# Altium schematic sheet USBC-DS1-100W-PD.SchDoc
size A3; SheetNumber: 1; SheetTotal: 4; SPICEModelCacheUZKMSWNJ: <root> / <DocumentId>UZKMSWNJ</DocumentId> / </root>
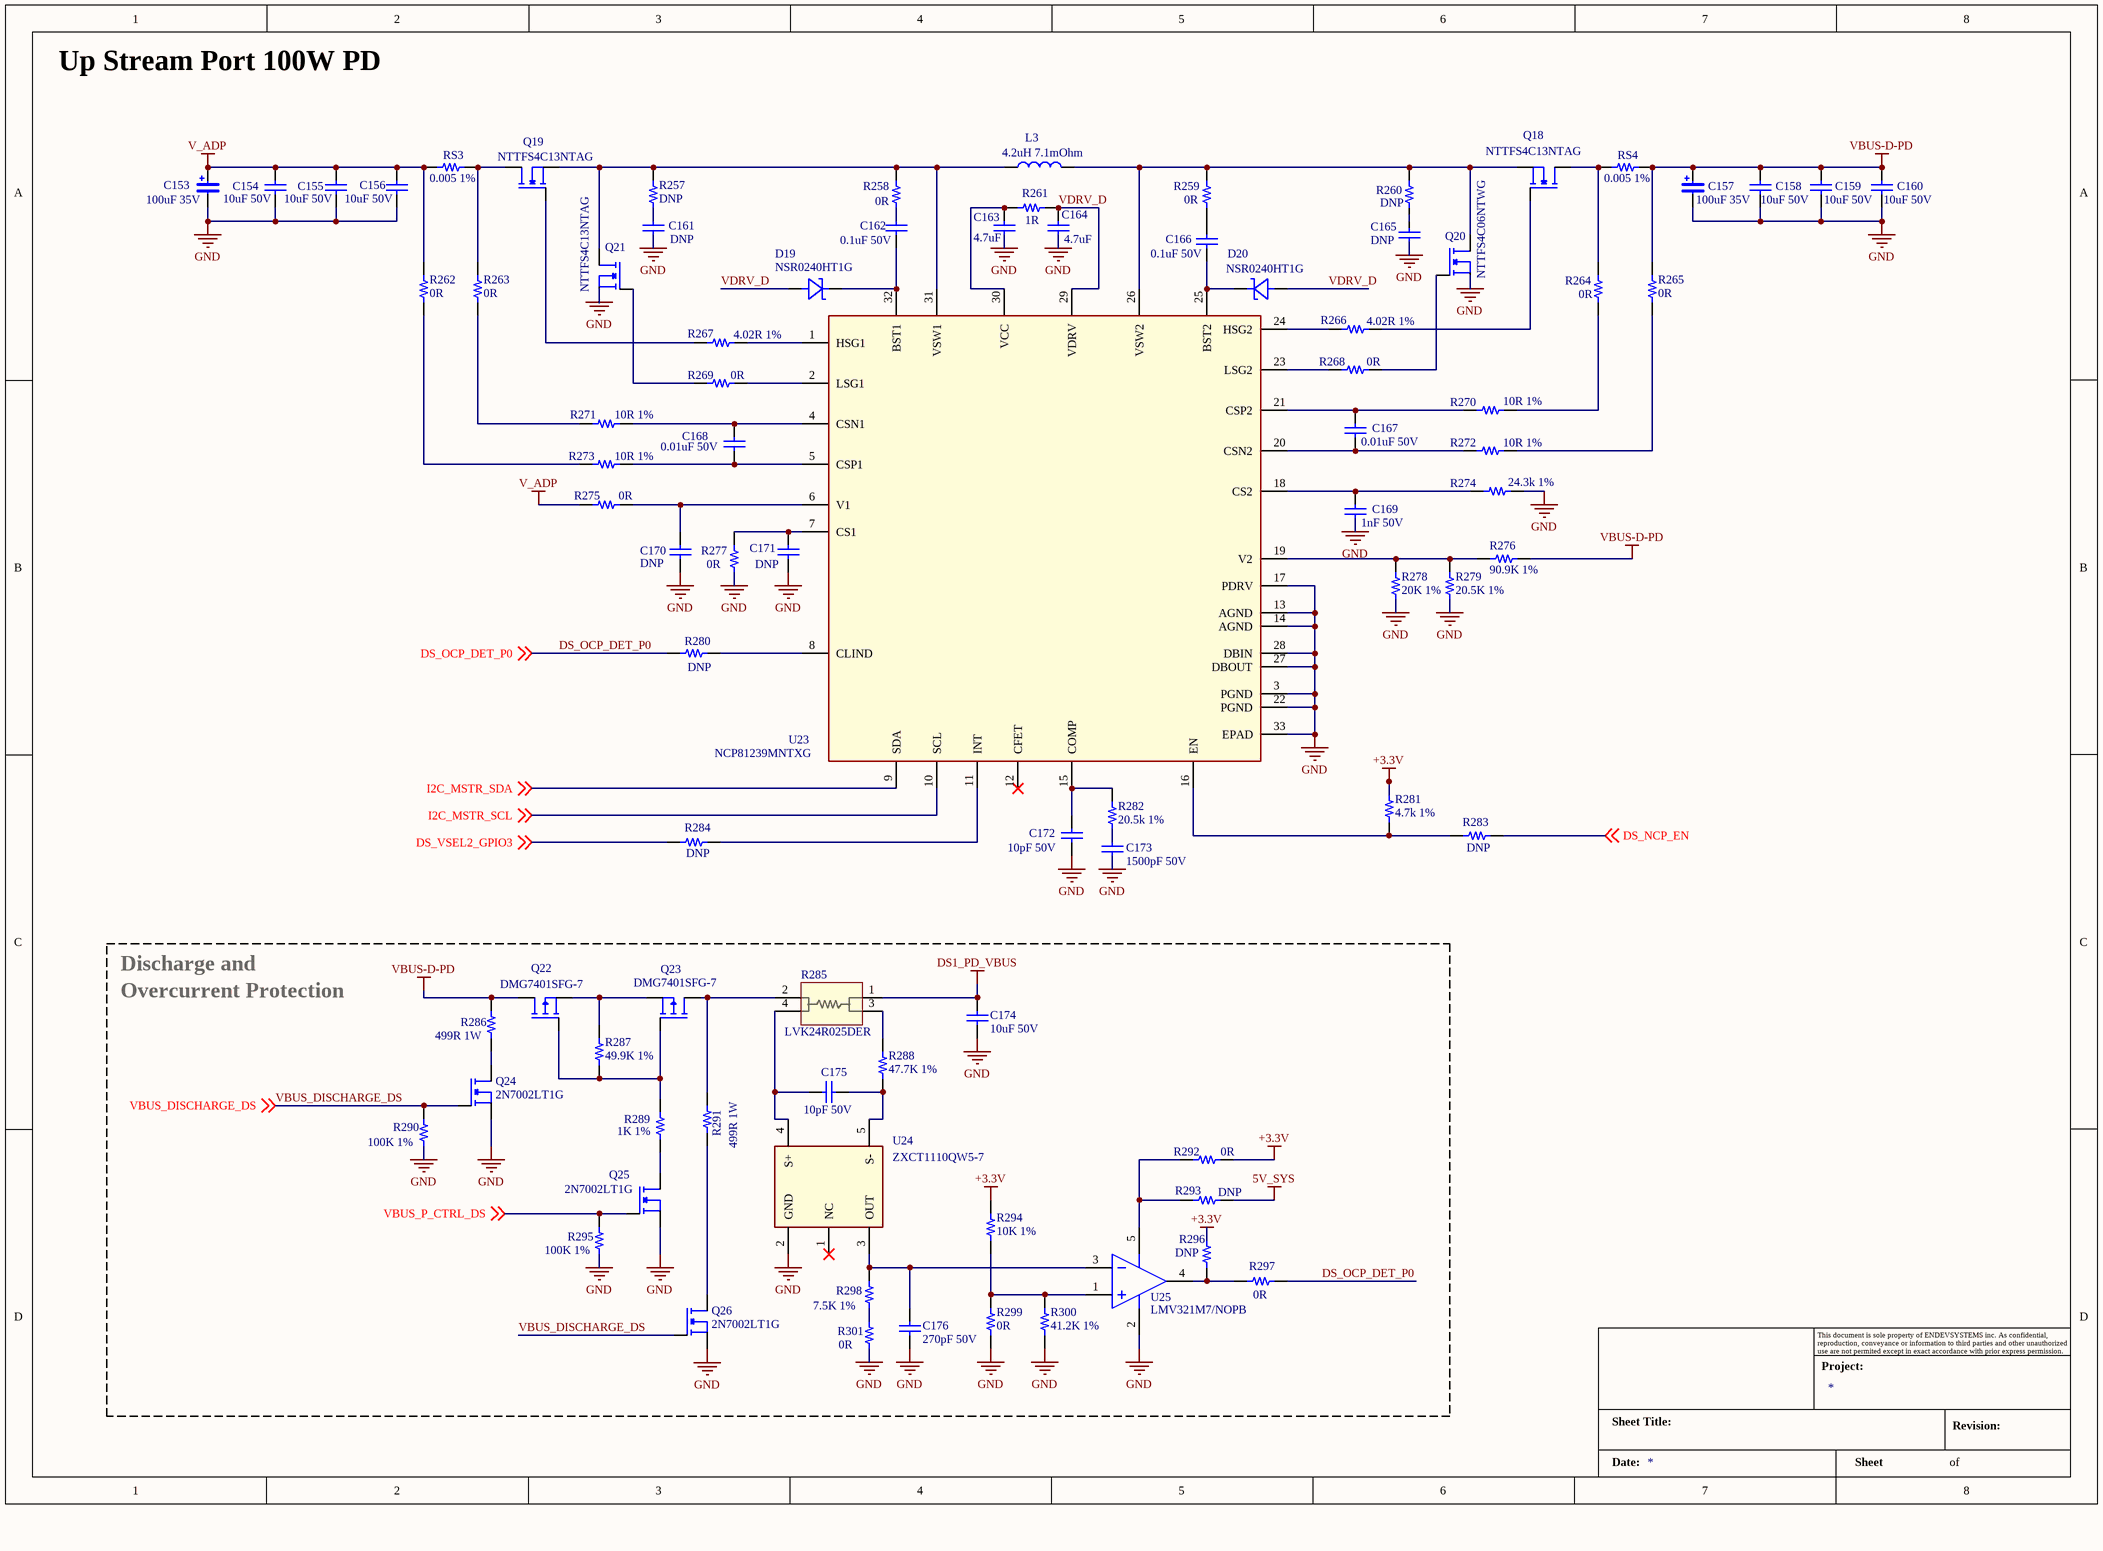
[diagram p0: USBC-DS1-100W-PD.SchDoc]

## Parts
?  Title_Block  (value not drawn)  (graphical)
C153  100uF 35V  [C-1206 (Tantalum)]
C154  10uF 50V  [C-0402/1005]
C155  10uF 50V  [C-0402/1005]
C156  10uF 50V  [C-0402/1005]
C157  100uF 35V  [C-1206 (Tantalum)]
C158  10uF 50V  [C-0402/1005]
C159  10uF 50V  [C-0402/1005]
C160  10uF 50V  [C-0402/1005]
C161  DNP  [C-0402/1005]
C162  0.1uF 50V  [C-0402/1005]
C163  4.7uF  [C-0402/1005]
C164  4.7uF  [C-0402/1005]
C165  DNP  [C-0402/1005]
C166  0.1uF 50V  [C-0402/1005]
C167  0.01uF 50V  [C-0402/1005]
C168  0.01uF 50V  [C-0402/1005]
C169  1nF 50V  [C-0402/1005]
C170  DNP  [C-0402/1005]
C171  DNP  [C-0402/1005]
C172  10pF 50V  [C-0402/1005]
C173  1500pF 50V  [C-0402/1005]
C174  value 10uF 50V  [C-0402/1005]  (hidden comment: 0.1uF)
C175  value 10pF 50V  [C-0402/1005]  (hidden comment: 0.1uF)
C176  value 270pF 50V  [C-0402/1005]  (hidden comment: 0.1uF)
D19  NSR0240HT1G  [SOIC-8 (W3.9mm) B]
D20  NSR0240HT1G  [SOIC-8 (W3.9mm) B]
L3  4.2uH 7.1mOhm  [4.3x4.3mm]
Q18  NTTFS4C13NTAG
Q19  NTTFS4C13NTAG
Q20  NTTFS4C06NTWG
Q21  NTTFS4C13NTAG
Q22  DMG7401SFG-7
Q23  DMG7401SFG-7
Q24  2N7002LT1G
Q25  2N7002LT1G
Q26  2N7002LT1G
R257  DNP  [R-0402]
R258  0R  [R-0402]
R259  0R  [R-0402]
R260  DNP  [R-0402]
R261  1R  [R-0402]
R262  0R  [R-0402]
R263  0R  [R-0402]
R264  0R  [R-0402]
R265  0R  [R-0402]
R266  4.02R 1%  [R-0402]
R267  4.02R 1%  [R-0402]
R268  0R  [R-0402]
R269  0R  [R-0402]
R270  10R 1%  [R-0402]
R271  10R 1%  [R-0402]
R272  10R 1%  [R-0402]
R273  10R 1%  [R-0402]
R274  24.3k 1%  [R-0402]
R275  0R  [R-0402]
R276  90.9K 1%  [R-0402]
R277  0R  [R-0402]
R278  20K 1%  [R-0402]
R279  20.5K 1%  [R-0402]
R280  DNP  [R-0402]
R281  4.7k 1%  [R-0402]
R282  20.5k 1%  [R-0402]
R283  DNP  [R-0402]
R284  DNP  [R-0402]
R285  LVK24R025DER  [LVK24_OHM]
R286  499R 1W  [R-0402]
R287  49.9K 1%  [R-0402]
R288  47.7K 1%  [R-0402]
R289  1K 1%  [R-0402]
R290  100K 1%  [R-0402]
R291  499R 1W  [R-0402]
R292  0R  [R-0402]
R293  DNP  [R-0402]
R294  10K 1%  [R-0402]
R295  100K 1%  [R-0402]
R296  DNP  [R-0402]
R297  0R  [R-0402]
R298  7.5K 1%  [R-0402]
R299  0R  [R-0402]
R300  41.2K 1%  [R-0402]
R301  0R  [R-0402]
RS3  0.005 1%  [R-0402]
RS4  0.005 1%  [R-0402]
U23  NCP81239MNTXG  [QFN32_5X5_ONS]
U24  ZXCT1110QW5-7  [MSOP-10-W3mm]
U25  LMV321M7/NOPB  [DCK0005A_M]

## Nets
5V_SYS: R293.1
+3.3V: R281.1 R292.1 R294.2 R296.2
DS1_PD_VBUS: C174.1 R285.1(E1)
GND: C153.- C154.1 C155.1 C156.1 C157.- C158.1 C159.1 C160.1 C161.1 C163.1 C164.1 C165.1 C169.1 C170.1 C171.1 C172.1 C173.1 C174.2 C176.2 Q20.2(S) Q21.2(S) Q24.2(S) Q25.2(S) Q26.2(S) R274.2 R277.2 R278.2 R279.2 R290.1 R295.1 R299.1 R300.1 R301.1 U23.3(PGND) U23.13(AGND) U23.14(AGND) U23.17(PDRV) U23.22(PGND) U23.27(DBOUT) U23.28(DBIN) U23.33(EPAD) U24.2(GND) U25.2(V-)
V_ADP: C153.+ C154.2 C155.2 C156.2 R262.1 R275.2 RS3.1
VBUS-D-PD: C157.+ C158.2 C159.2 C160.2 Q22.3 R265.2 R276.2 R286.2 RS4.2
DS_NCP_EN: R283.2 ; off-sheet DS_NCP_EN
DS_OCP_DET_P0: R280.2 R297.1 ; off-sheet DS_OCP_DET_P0
DS_VSEL2_GPIO3: R284.2 ; off-sheet DS_VSEL2_GPIO3
I2C_MSTR_SCL: U23.10(SCL) ; off-sheet I2C_MSTR_SCL
I2C_MSTR_SDA: U23.9(SDA) ; off-sheet I2C_MSTR_SDA
VBUS_DISCHARGE_DS: Q24.1(G) Q26.1(G) R290.2 ; off-sheet VBUS_DISCHARGE_DS
VBUS_P_CTRL_DS: Q25.1(G) R295.2 ; off-sheet VBUS_P_CTRL_DS
VDRV_D: C164.2 D19.A D20.A R261.1 U23.29(VDRV)
NetC161_2: C161.2 R257.1
NetC162_1: C162.1 D19.C U23.32(BST1)
NetC162_2: C162.2 R258.1
NetC163_2: C163.2 R261.2 U23.30(VCC)
NetC165_2: C165.2 R260.1
NetC166_1: C166.1 D20.C U23.25(BST2)
NetC166_2: C166.2 R259.1
NetC167_1: C167.1 R272.2 U23.20(CSN2)
NetC167_2: C167.2 R270.2 U23.21(CSP2)
NetC168_1: C168.1 R273.1 U23.5(CSP1)
NetC168_2: C168.2 R271.1 U23.4(CSN1)
NetC169_2: C169.2 R274.1 U23.18(CS2)
NetC170_2: C170.2 R275.1 U23.6(V1)
NetC171_2: C171.2 R277.1 U23.7(CS1)
NetC172_2: C172.2 R282.1 U23.15(COMP)
NetC173_2: C173.2 R282.2
NetC175_1: C175.1 R288.1 U24.5(S-)
NetC175_2: C175.2 R285.4 U24.4(S+)
NetC176_1: C176.1 R298.2 U24.3(OUT) U25.3(IN-)
NetL3_1: L3.1 Q19.2(S) Q21.3(D) R257.2 R258.2 U23.31(VSW1)
NetL3_2: L3.2 Q18.2(S) Q20.3(D) R259.2 R260.2 U23.26(VSW2)
NetQ18_1: Q18.1(G) R266.1
NetQ18_3: Q18.3(D) R264.2 RS4.1
NetQ19_1: Q19.1(G) R267.2
NetQ19_3: Q19.3(D) R263.1 RS3.2
NetQ20_1: Q20.1(G) R268.1
NetQ21_1: Q21.1(G) R269.2
NetQ22_1: Q22.1 Q23.1 R287.1 R289.2
NetQ22_2: Q22.2 Q23.2 R287.2
NetQ23_3: Q23.3 R285.2(E2) R291.2
NetQ24_3: Q24.3(D) R286.1
NetQ25_3: Q25.3(D) R289.1
NetQ26_3: Q26.3(D) R291.1
NetR262_2: R262.2 R273.2
NetR263_2: R263.2 R271.2
NetR264_1: R264.1 R270.1
NetR265_1: R265.1 R272.1
NetR266_2: R266.2 U23.24(HSG2)
NetR267_1: R267.1 U23.1(HSG1)
NetR268_2: R268.2 U23.23(LSG2)
NetR269_1: R269.1 U23.2(LSG1)
NetR276_1: R276.1 R278.1 R279.1 U23.19(V2)
NetR280_1: R280.1 U23.8(CLIND)
NetR281_2: R281.2 R283.1 U23.16(EN)
NetR284_1: R284.1 U23.11(INT)
NetR285_3: R285.3 R288.2
NetR292_2: R292.2 R293.2 U25.5(V+)
NetR294_1: R294.1 R299.2 R300.2 U25.1(IN+)
NetR296_1: R296.1 R297.2 U25.4(OUT)
NetR298_1: R298.1 R301.2

Not connected (* = marked no-connect by the designer): U23 12(CFET)*; U24 1(NC)*

## Notes on the sheet
- Up Stream Port 100W PD
- Discharge and
- Overcurrent Protection
- (in symbol Title_Block) This document is sole property of ENDEVSYSTEMS inc. As confidential, reproduction, conveyance or information to third parties and other unauthorized use are not permited except in exact accordance with prior express permission.; Project:; Sheet Title:; Revision:; Date:; Sheet; of

## Library data of the parts
C153 C157 = Capacitor-Polar: CAP TANT 10UF 10% 16V 1206; Mfr. Part No.: F931C106KAAAJ6; Unit Price (USD): 0.67; Value: 10uF 16V; Supplier Part No.: 478-10723-1-ND; Supplier: Digikey Electronics
C154-C156 C158-C161 C163-C165 C167-C173 = Cap: Capacitor; Value: 0.1uF; Published: 8-Jun-2000; LatestRevisionDate: 17-Jul-2002; LatestRevisionNote: Re-released for DXP Platform.; PackageReference: RAD-0.3; Publisher: Altium Limited; PackageDescription: Radial Cap, Thru-Hole; 2 Leads; 0.3 in Pin Spacing
C162 C166 C174-C176 = Cap: Capacitor; Published: 8-Jun-2000; LatestRevisionDate: 17-Jul-2002; LatestRevisionNote: Re-released for DXP Platform.; PackageReference: RAD-0.3; Publisher: Altium Limited; PackageDescription: Radial Cap, Thru-Hole; 2 Leads; 0.3 in Pin Spacing
  C162 C166: Value: 0.1uF
D19 D20 = Diode-Schottky: Supplier: Digikey Electronics
L3 = 4.3x4.3mm: FIXED IND 22UH 620MA 350 MOHM; Mfr. Part No.: ASPI-4020S-220M-T; Unit Price (USD): 0.48; Supplier Part No.: 535-12307-1-ND; Value: 22uH; Supplier: Digikey Electronics
Q18-Q21 Q24-Q26 = MOSFET-N: Supplier: Digikey Electronics
Q22 Q23 = MOSFET-P: Supplier: Digikey Electronics
R257-R284 R286-R301 RS3 RS4 = Resistor: RES SMD 51 OHM 0.5% 1/16W 0402; Mfr. Part No.: ERA-2AED510X; Value: 51R; Unit Price (USD): 0.21; Supplier Part No.: P51DECT-ND; Supplier: Digikey Electronics
R285 = LVK24R025DER: No Description Available; Mfr_Name: Ohmite; RefDes: RefDes; Type: Type
U23 = NCP81239MNTXG: No Description Available; Mfr_Name: onsemi; RefDes: RefDes; Type: Type
U24 = LT8607EMSE#PBF: IC REG BUCK ADJ 750MA 8DFN; Mfr. Part No.: LT8607EDC#TRMPBF; Unit Price (USD): 5.48; Supplier: Digikey Electronics; Supplier Part No.: LT8607EMSE#PBF-ND
U25 = CMP-0055-01046-3: General Purpose, Low Voltage, Rail-to-Rail Output Operational Amplifiers, 5-pin SC-70, Pb-Free; Manufacturer: Texas Instruments; PackageTopMarking: A12*XTT; PowerWise: N; CompType: Amplifiers; ComponentLink1Description: Datasheet URL; Code_JEITA: SC-88A; ComponentLink1URL: http://www.ti.com/general/docs/lit/getliterature.tsp?genericPartNumber=LMV321-N&fileType=pdf; Code_IPC: SOT353-5; PinCount: 5; RoHS: Y; Code_JEDEC: MO-203-AA; PackageDescription: Molded SC-70, 2 x 1.25 x .9mm, 5 Lead, 0.65mm Pitch; Package Reference: DCK0005A
? = Title_Block: Date:: *; Project:: *